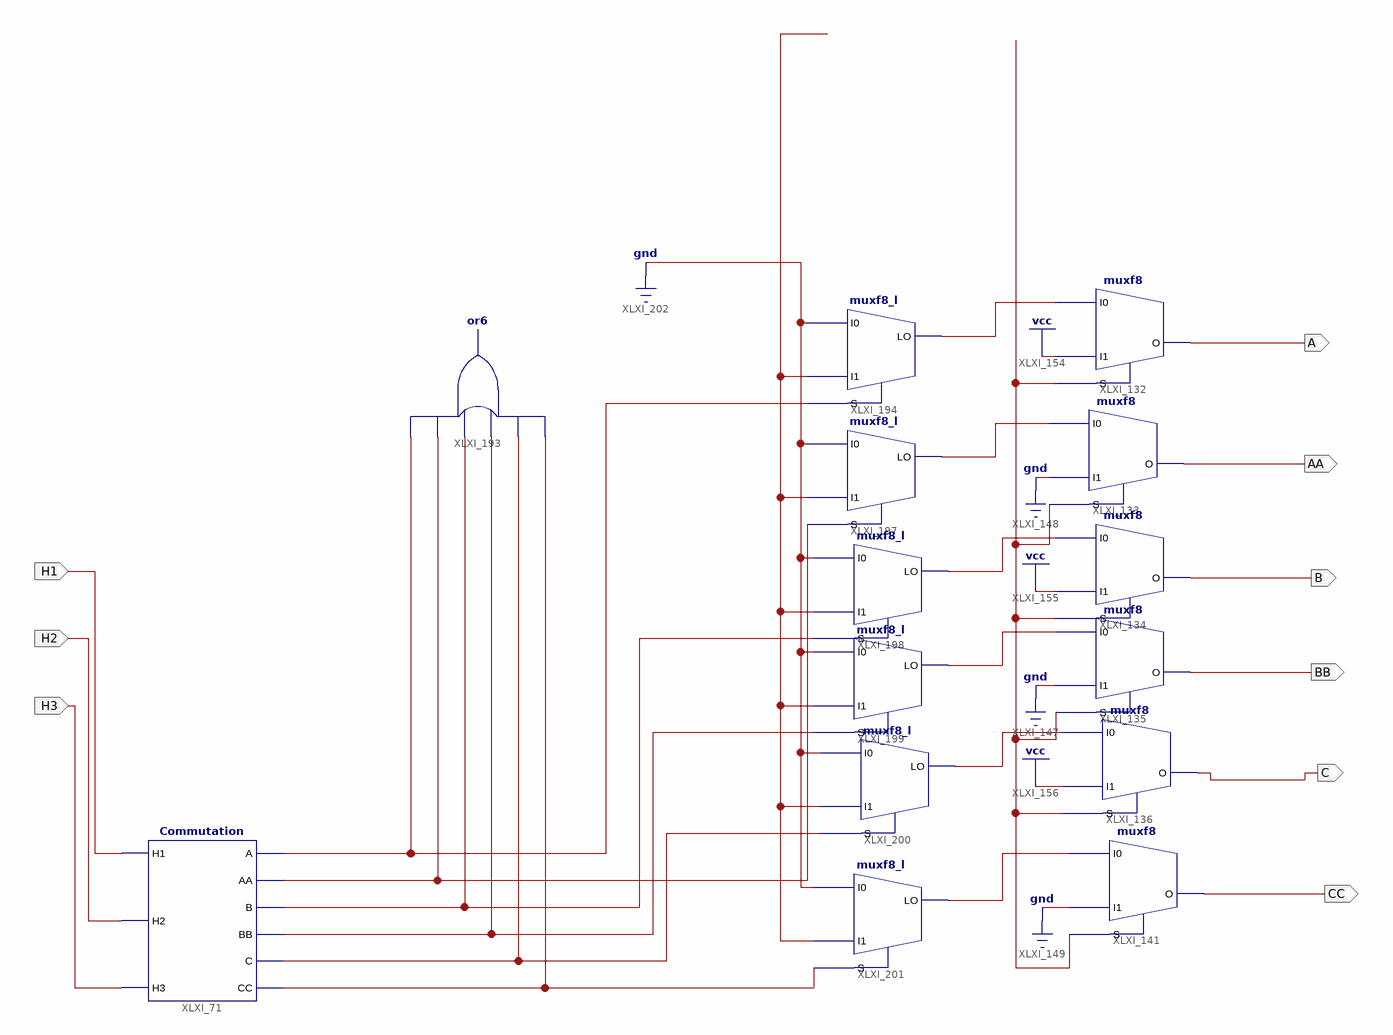
[diagram p0: schematic sheet 1]
// Xilinx ISE schematic MAIN_2.sch (spartan3e) as structural Verilog: 14 symbols, 9 ports
module MAIN_2 (
  input  H3,
  input  H2,
  input  H1,
  output A,
  output AA,
  output B,
  output BB,
  output C,
  output CC
);

  wire XLXN_171, XLXN_267, XLXN_268, XLXN_269, XLXN_270, XLXN_271, XLXN_272, XLXN_366, XLXN_369, XLXN_370,
       XLXN_372, XLXN_375, XLXN_393, XLXN_395;

  muxf8 XLXI_132 (.I0(XLXN_267), .I1(1'b1), .S(XLXN_395), .O(A));
  muxf8 XLXI_133 (.I0(XLXN_268), .I1(1'b0), .S(XLXN_395), .O(AA));
  muxf8 XLXI_134 (.I0(XLXN_269), .I1(1'b1), .S(XLXN_395), .O(B));
  muxf8 XLXI_135 (.I0(XLXN_270), .I1(1'b0), .S(XLXN_395), .O(BB));
  muxf8 XLXI_136 (.I0(XLXN_271), .I1(1'b1), .S(XLXN_395), .O(C));
  muxf8 XLXI_141 (.I0(XLXN_272), .I1(1'b0), .S(XLXN_395), .O(CC));
  Commutation XLXI_71 (
    .H1(H1), .H2(H2), .H3(H3), .A(XLXN_369), .AA(XLXN_366), .B(XLXN_370), .BB(XLXN_372), .C(XLXN_171),
    .CC(XLXN_375));
  // or6 XLXI_193 has open pins: I0=XLXN_375, I1=XLXN_171, I2=XLXN_372, I3=XLXN_370, I4=XLXN_366, I5=XLXN_369, O=open
  muxf8_l XLXI_194 (.I0(1'b0), .I1(XLXN_393), .S(XLXN_369), .LO(XLXN_267));
  muxf8_l XLXI_197 (.I0(1'b0), .I1(XLXN_393), .S(XLXN_366), .LO(XLXN_268));
  muxf8_l XLXI_198 (.I0(1'b0), .I1(XLXN_393), .S(XLXN_370), .LO(XLXN_269));
  muxf8_l XLXI_199 (.I0(1'b0), .I1(XLXN_393), .S(XLXN_372), .LO(XLXN_270));
  muxf8_l XLXI_200 (.I0(1'b0), .I1(XLXN_393), .S(XLXN_171), .LO(XLXN_271));
  muxf8_l XLXI_201 (.I0(1'b0), .I1(XLXN_393), .S(XLXN_375), .LO(XLXN_272));
endmodule
